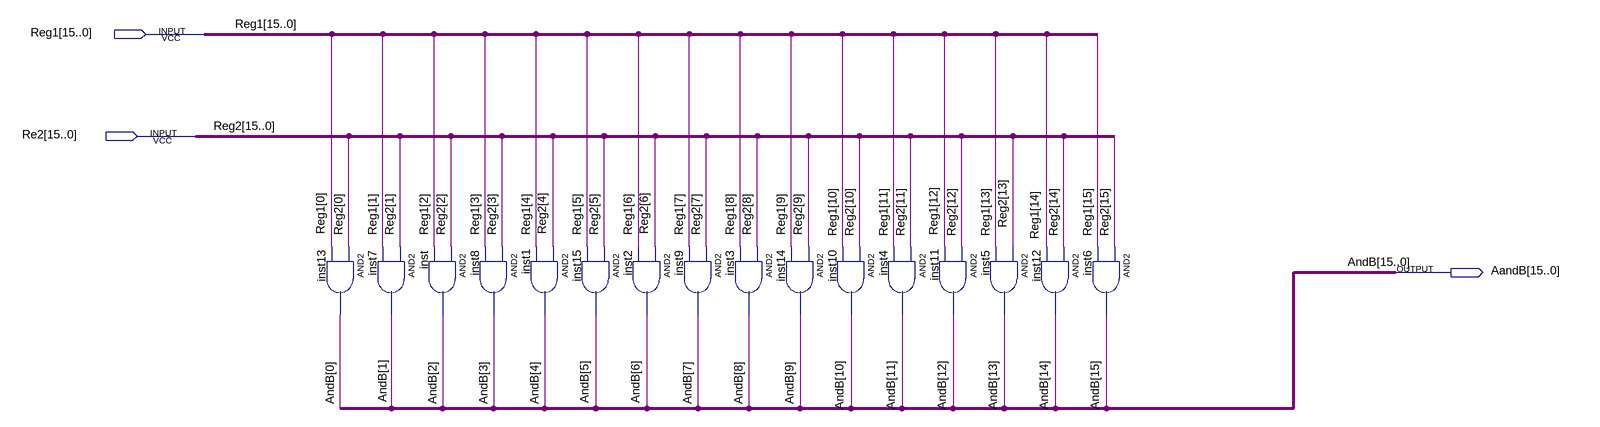
[diagram p0: schematic sheet]
// Quartus schematic 16_bit_AND.bdf as structural Verilog: 16 symbols, 3 pins
module \16_bit_AND  (
  input  [15:0] Reg1,
  input  [15:0] Re2,
  output [15:0] AandB
);

  and inst13 (AandB[0], Re2[0], Reg1[0]);
  and inst (AandB[2], Re2[2], Reg1[2]);
  and inst7 (AandB[1], Re2[1], Reg1[1]);
  and inst8 (AandB[3], Re2[3], Reg1[3]);
  and inst1 (AandB[4], Re2[4], Reg1[4]);
  and inst2 (AandB[6], Re2[6], Reg1[6]);
  and inst15 (AandB[5], Re2[5], Reg1[5]);
  and inst9 (AandB[7], Re2[7], Reg1[7]);
  and inst3 (AandB[8], Re2[8], Reg1[8]);
  and inst10 (AandB[10], Re2[10], Reg1[10]);
  and inst14 (AandB[9], Re2[9], Reg1[9]);
  and inst4 (AandB[11], Re2[11], Reg1[11]);
  and inst11 (AandB[12], Re2[12], Reg1[12]);
  and inst5 (AandB[13], Re2[13], Reg1[13]);
  and inst12 (AandB[14], Re2[14], Reg1[14]);
  and inst6 (AandB[15], Re2[15], Reg1[15]);

  // Other names for the same wires on the sheet: AndB[15:0] = AandB; Reg2[15:0] = Re2
endmodule
